# Altium schematic sheet GTM_OKON.SchDoc: Wprowadź Tytuł
size 193 x 292 mm; CheckedBy: Wprowadź sprawdzającego; DrawnBy: Wprowadź autora; Organization: Koło Naukowe Robotyków; Address1: Nowowiejska 24; Address2: 00-001; Address3: Wraszawa; Address4: Polska; Revision: Numer; Nazwa Arkusza: Wpisz nazwę arkusza; ProjectName: Nazwa Projektu
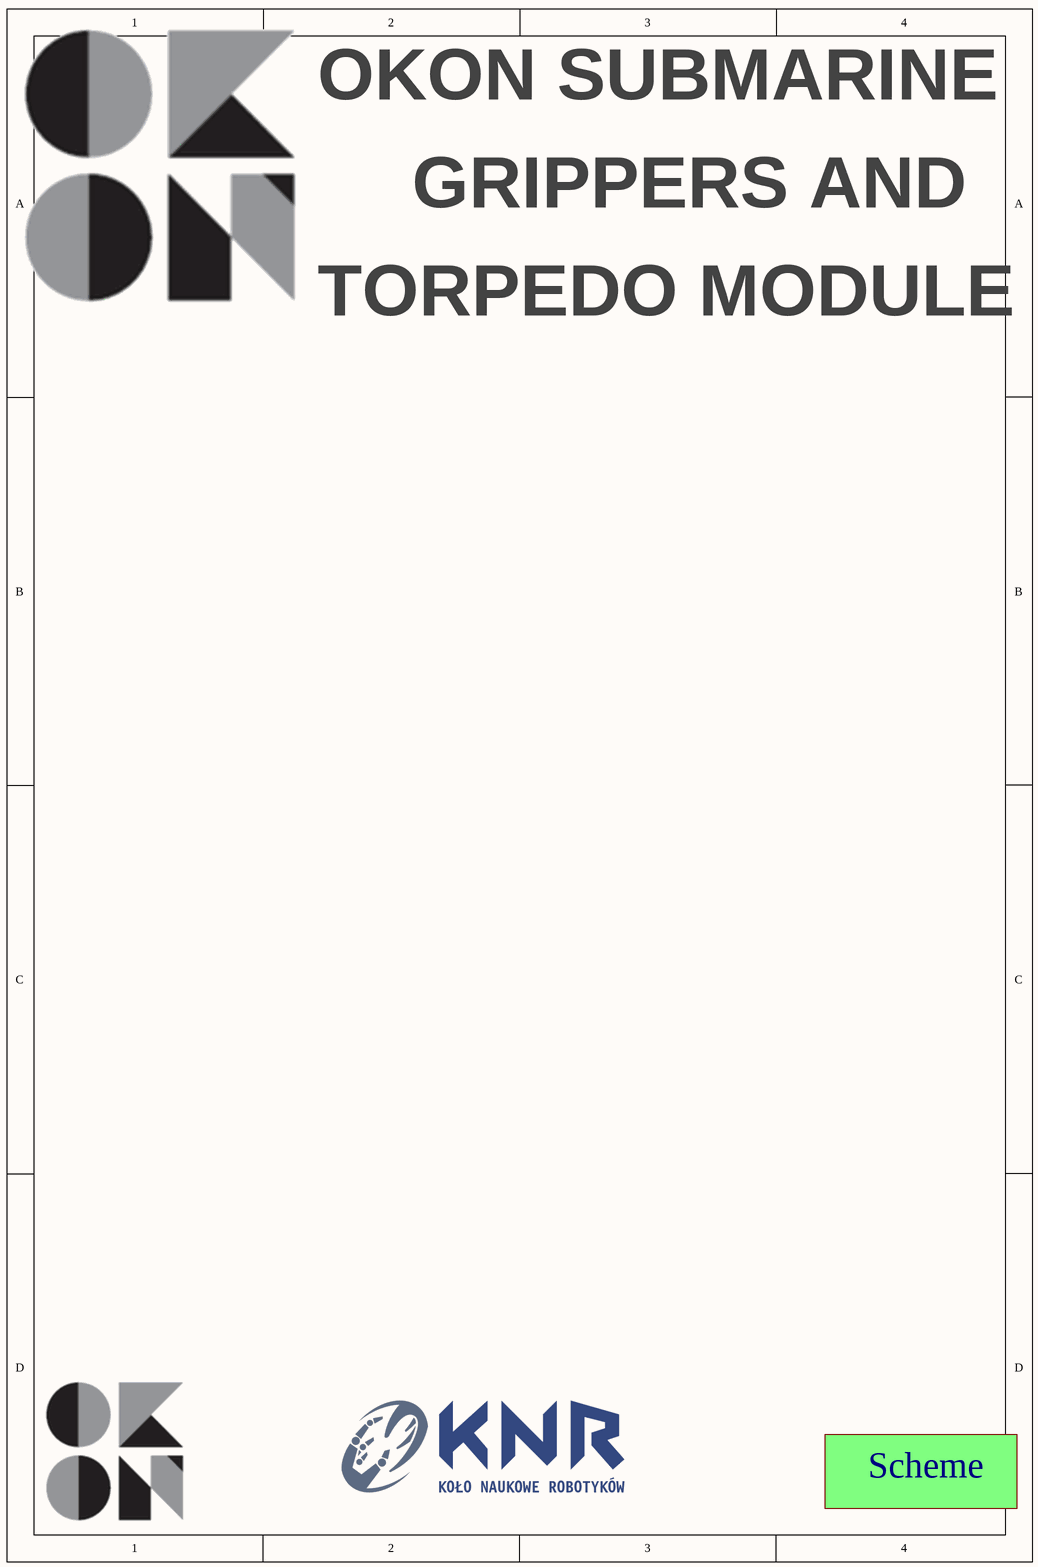
[diagram p0: GTM_OKON.SchDoc]

## Sub-sheets
Designator = GTM_Connectors.SchDoc: no entries

## Notes on the sheet
- OKON SUBMARINE
- GRIPPERS AND
- TORPEDO MODULE
- Scheme
- Title
- Size:
- Date:
- A4
- Number:
- Time:
- Revision:
- Sheet
- of
- File: